# EAGLE design tempShield (EAGLE 7.7.0)
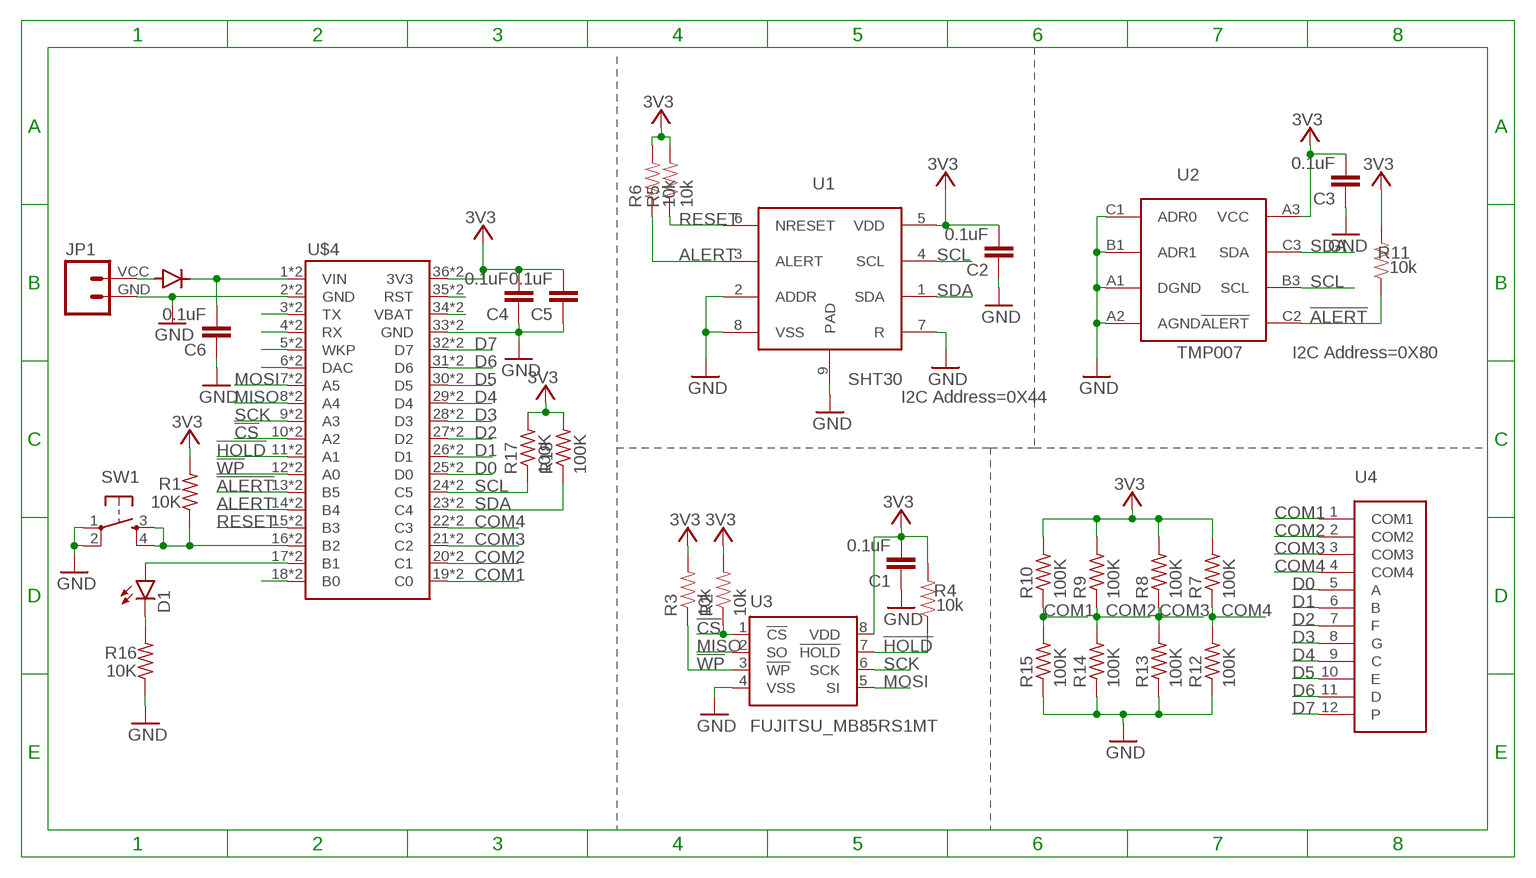
[diagram p0: schematic, sheet 1]

## Parts
C1  0.1uF  0.22UF50V-20%,+80%(0603)  [0603-CAP]
C2  0.1uF  0.22UF50V-20%,+80%(0603)  [0603-CAP]
C3  0.1uF  0.22UF50V-20%,+80%(0603)  [0603-CAP]
C4  0.1uF  0.22UF50V-20%,+80%(0603)  [0603-CAP]
C5  0.1uF  0.22UF50V-20%,+80%(0603)  [0603-CAP]
C6  0.1uF  0.22UF50V-20%,+80%(0603)  [0603-CAP]
D1  LED0603  [LED-0603]
JP1  SPARKFUN-CONNECTORS_M024UCON-15767  [SPARKFUN-CONNECTORS_JST-2-SMD-VERT]
R1  10K  R-US_R0402  [R0402]
R2  10k  0.27OHM-1/10W-1%(0603)  [0603-RES]
R3  10k  0.27OHM-1/10W-1%(0603)  [0603-RES]
R4  10k  0.27OHM-1/10W-1%(0603)  [0603-RES]
R5  10k  0.27OHM-1/10W-1%(0603)  [0603-RES]
R6  10k  0.27OHM-1/10W-1%(0603)  [0603-RES]
R7  100K  R-US_R0402  [R0402]
R8  100K  R-US_R0402  [R0402]
R9  100K  R-US_R0402  [R0402]
R10  100K  R-US_R0402  [R0402]
R11  10k  0.27OHM-1/10W-1%(0603)  [0603-RES]
R12  100K  R-US_R0402  [R0402]
R13  100K  R-US_R0402  [R0402]
R14  100K  R-US_R0402  [R0402]
R15  100K  R-US_R0402  [R0402]
R16  10K  R-US_R0402  [R0402]
R17  100K  R-US_R0402  [R0402]
R18  100K  R-US_R0402  [R0402]
SW1  SWITCH_SPST_4_PIN  [TACTILE-SWITCH-SMD]
U1  SHT30  SHT30SHT30  [SHT30]
U2  TMP007  [TMP007_1]
U3  FUJITSU_MB85RS1MT  [FUJITSU_SO08]
U4  LCD  [LCD]
U$1  PARTICLE_DIODE_NT  [PARTICLE_DIODE-DO-220AA_NT(SMP)]
U$4  MICROBUILDER_ELECTRON_SMT  [MICROBUILDER_ELECTRON_SMT]

## Nets
!ALERT: R11.1 U2.C2(!ALERT!) U$4.13(B5) U$4.13B(B5)
!CS: R2.1 U3.1(!CS) U$4.10(A2) U$4.10B(A2)
!HOLD: R4.1 U3.7(!HOLD) U$4.11(A1) U$4.11B(A1)
!WP: R3.1 U3.3(!WP) U$4.12(A0) U$4.12B(A0)
+3V3: C1.2 C2.2 C3.2 C4.2 C5.2 R1.2 R2.2 R3.2 R4.2 R5.2 R6.2 R7.2 R8.2 R9.2 R10.2 R11.2 R17.2 R18.2 U1.5(VDD) U2.A3(VCC) U3.8(VDD) U$4.36(3V3) U$4.36B(3V3) ; supply symbol labelled 3V3
ALERT: R6.1 U1.3(ALERT) U$4.14(B4) U$4.14B(B4)
COM1: R10.1 R15.2 U4.1(COM1) U$4.19(C0) U$4.19B(C0)
COM2: R9.1 R14.2 U4.2(COM2) U$4.20(C1) U$4.20B(C1)
COM3: R8.1 R13.2 U4.3(COM3) U$4.21(C2) U$4.21B(C2)
COM4: R7.1 R12.2 U4.4(COM4) U$4.22(C3) U$4.22B(C3)
D0: U4.5(A) U$4.25(D0) U$4.25B(D0)
D1: U4.6(B) U$4.26(D1) U$4.26B(D1)
D2: U4.7(F) U$4.27(D2) U$4.27B(D2)
D3: U4.8(G) U$4.28(D3) U$4.28B(D3)
D4: U4.9(C) U$4.29(D4) U$4.29B(D4)
D5: U4.10(E) U$4.30(D5) U$4.30B(D5)
D6: U4.11(D) U$4.31(D6) U$4.31B(D6)
D7: U4.12(P) U$4.32(D7) U$4.32B(D7)
GND: C1.1 C2.1 C3.1 C4.1 C5.1 C6.1 JP1.GND R12.1 R13.1 R14.1 R15.1 R16.1 SW1.1 SW1.2 U1.2(ADDR) U1.7(R) U1.8(VSS) U1.9(PAD) U2.A1(DGND) U2.A2(AGND) U2.B1(ADR1) U2.C1(ADR0) U3.4(VSS) U$4.2(GND) U$4.2B(GND) U$4.33(GND) U$4.33B(GND)
MISO: U3.2(SO) U$4.8(A4) U$4.8B(A4)
MOSI: U3.5(SI) U$4.7(A5) U$4.7B(A5)
N$1: C6.2 U$1.CATHODE U$4.1(VIN) U$4.1B(VIN)
N$2: D1.A U$4.17(B1) U$4.17B(B1)
N$3: JP1.VCC U$1.ANODE
N$4: R1.1 SW1.3 SW1.4 U$4.16(B2) U$4.16B(B2)
N$5: D1.C R16.2
N$6: U$4.35(RST) U$4.35B(RST)
N$7: U$4.34(VBAT) U$4.34B(VBAT)
N$8: U$4.3(TX) U$4.3B(TX)
N$9: U$4.4(RX) U$4.4B(RX)
N$10: U$4.5(WKP) U$4.5B(WKP)
N$11: U$4.6(DAC) U$4.6B(DAC)
N$12: U$4.18(B0) U$4.18B(B0)
RESET: R5.1 U1.6(NRESET) U$4.15(B3) U$4.15B(B3)
SCK: U3.6(SCK) U$4.9(A3) U$4.9B(A3)
SCL: R17.1 U1.4(SCL) U2.B3(SCL) U$4.24(C5) U$4.24B(C5)
SDA: R18.1 U1.1(SDA) U2.C3(SDA) U$4.23(C4) U$4.23B(C4)

## Notes on the sheet
- I2C Address=0X80
- I2C Address=0X44

## Library data of the parts
C1-C6 = SparkFun-Capacitors:0.22UF50V-20%,+80%(0603): CAP-09885; PROD_ID: CAP-09885; VALUE: 0.22uF
D1 = SparkFun-LED:LED: LEDs Standard schematic elements and footprints for 5mm, 3mm, 1206, and 0603 sized LEDs. 5mm - Spark Fun Electronics SKU : COM-00529 (and others)
JP1 = electron_v020:SPARKFUN-CONNECTORS_M02: Standard 2-pin 0.1" header. Use with - straight break away headers ( PRT-00116) - right angle break away headers (PRT-00553) - swiss pins (PRT-00743) - machine pins (PRT-00117) - female headers (PRT-00115) Molex polarized connector foot print use with: PRT-08233 with associated crimp pins and housings. 2.54_SCREWTERM for use with PRT-10571. 3.5mm Screw Terminal footprints for PRT-08084 5mm Screw Terminal footprints for use with PRT-08432
R1 R7-R10 R12-R18 = programming-rig-v402:R-US_: RESISTOR, American symbol
R2-R6 R11 = SparkFun-Resistors:0.27OHM-1/10W-1%(0603): RES-08787; PROD_ID: RES-08787
SW1 = SparkFun-Electromechanical:SWITCH_SPST_4_PIN; PROD_ID: SWCH-08247
U1 = Particle:SHT30
U2 = Particle:TMP007
U3 = fuelview_v001:FUJITSU_MB85RS1MT
U4 = Particle:LCD
U$1 = electron_v020:PARTICLE_DIODE
U$4 = asset-tracker-v007:MICROBUILDER_ELECTRON

## Board
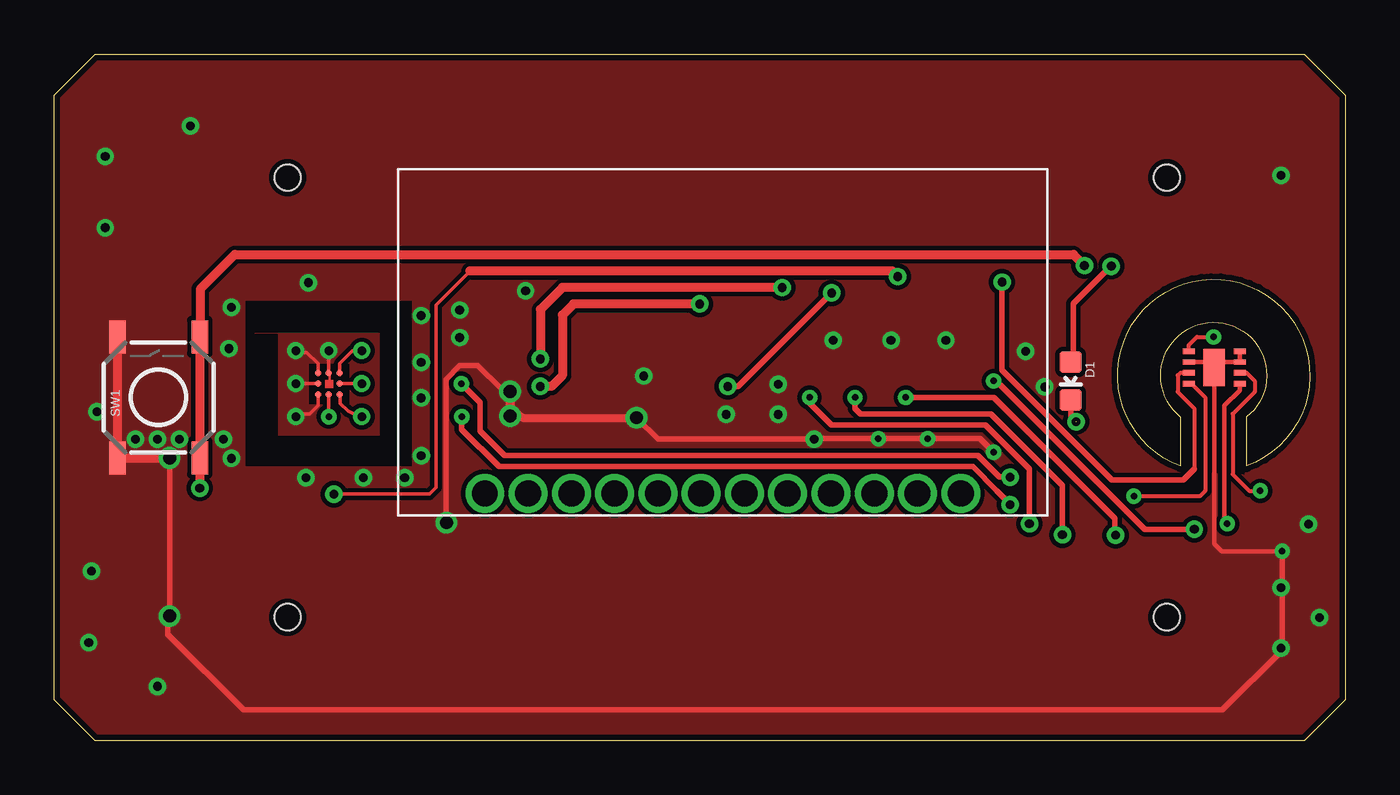
[diagram p1: board, top side]
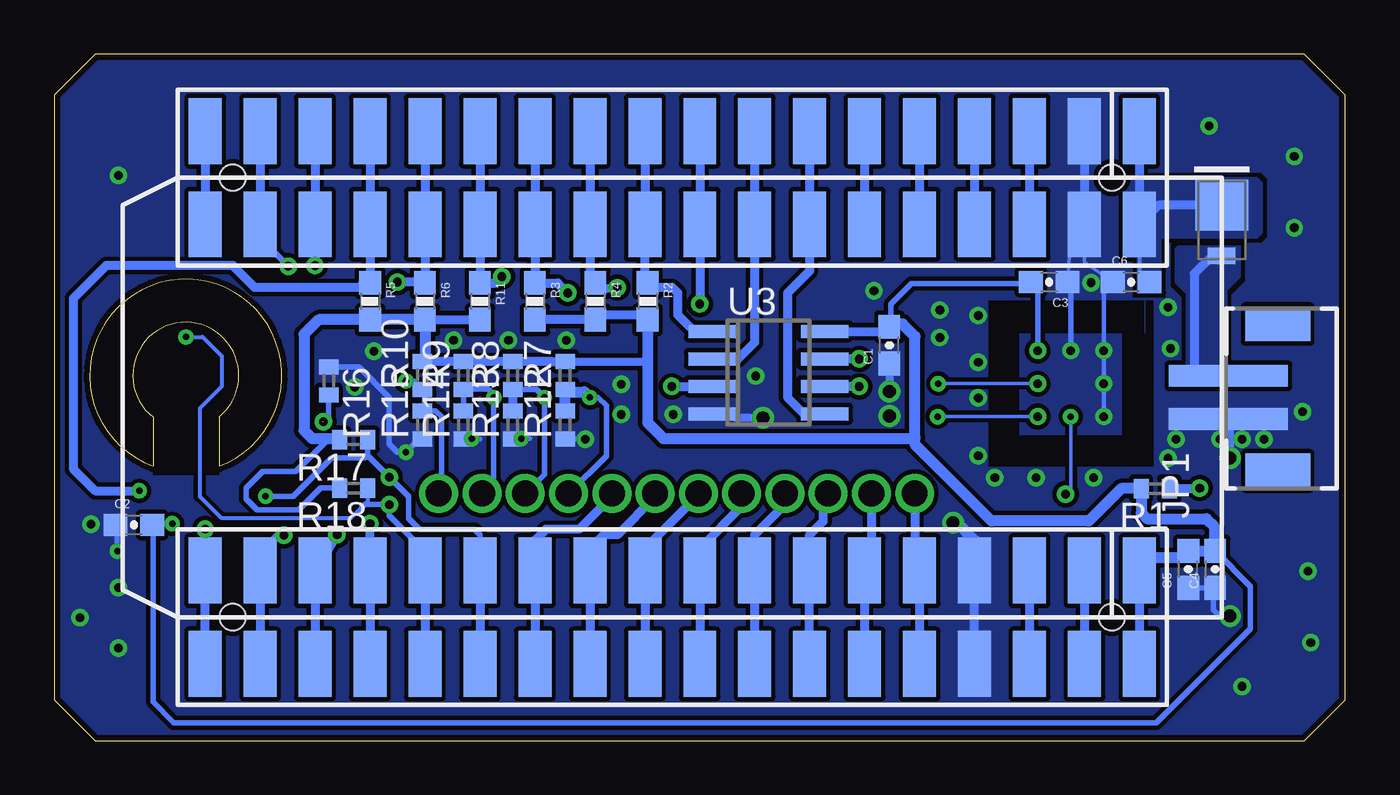
[diagram p2: board, bottom side, seen from below]

Size 59.69 x 31.75 mm. Coordinates in mm from the lower left corner, seen from the top.
Outline: 1.91,31.75 57.78,31.75 59.69,29.84 59.69,1.91 57.78,0 1.91,0 0,1.91 0,29.84 1.91,31.75
Outline: 53.57,19.36 arc-142 55.12,14.96 55.12,12.7 arc167 53.03,21.31 arc152 52.07,12.7 52.07,14.96 arc-140 53.57,19.36
Copper layers (1*16): Top 0.035mm / dielectric 1.5mm / Bottom 0.035mm
Design rules "default *": minimum track width 4mil, minimum drill 0.3mm, track to track 8mil, track to pad 8mil, pad to pad 8mil, via to via 8mil, smd to smd 8mil, copper to edge 10mil, drill to drill 8mil, minimum pad ring 10mil, minimum via ring 8mil, stop-mask expansion 4mil, vias tented up to drill 0.7mm, thermal gap 10mil

### Footprints (pad centres in the part's own frame; a part is rotated, then mirrored left to right if it is on the bottom)
0603-CAP = smd 1.1 x 1: 1 -0.85,0; 2 0.85,0
LED-0603 = smd 1 x 1: A 0,-0.877; C 0,0.877
SPARKFUN-CONNECTORS_JST-2-SMD-VERT = smd 1 x 5.5: GND 1,-2; VCC -1,-2 | smd 1.6 x 3: P$1 -3.4,0.27; P$2 3.4,0.27
R0402 = smd 0.7 x 0.9: 1 -0.65,0; 2 0.65,0
0603-RES = smd 1.1 x 1: 1 -0.85,0; 2 0.85,0
TACTILE-SWITCH-SMD = smd 1.524 x 0.762: 1 -2.794,1.905; 2 2.794,1.905; 3 -2.794,-1.905; 4 2.794,-1.905
SHT30 = smd 0.55 x 0.25: 1 0,1.5; 2 0,1; 3 0,0.5; 4 0,0; 5 2.35,0; 6 2.35,0.5; 7 2.35,1; 8 2.35,1.5 | smd 1 x 1.7: 9 1.175,0.75
TMP007_1 = smd 0.29 x 0.29: A1 -0.5,0.5; A2 0,0.5; A3 0.5,0.5; B1 -0.5,0; B3 0.5,0; C1 -0.5,-0.5; C2 0,-0.5; C3 0.5,-0.5
FUJITSU_SO08 = smd 0.6 x 2.2: 1 -1.905,-2.6; 2 -0.635,-2.6; 3 0.635,-2.6; 4 1.905,-2.6; 5 1.905,2.6; 6 0.635,2.6; 7 -0.635,2.6; 8 -1.905,2.6
LCD = drill 1.2 pad 1.5: 1 0,0; 2 2,0; 3 4,0; 4 6,0; 5 8,0; 6 10,0; 7 12,0; 8 14,0; 9 16,0; 10 18,0; 11 20,0; 12 22,0
PARTICLE_DIODE-DO-220AA_NT(SMP) = smd 0.762 x 1.27: ANODE 2.349,0 | smd 2.337 x 2.464: CATHODE 0,0
MICROBUILDER_ELECTRON_SMT = smd 3.048 x 1.524: 1 -12.319,21.59; 1B -8.001,21.59; 2 -12.319,19.05; 2B -8.001,19.05; 3 -12.319,16.51; 3B -8.001,16.51; 4 -12.319,13.97; 4B -8.001,13.97; 5 -12.319,11.43; 5B -8.001,11.43; 6 -12.319,8.89; 6B -8.001,8.89; 7 -12.319,6.35; 7B -8.001,6.35; 8 -12.319,3.81; 8B -8.001,3.81; 9 -12.319,1.27; 9B -8.001,1.27; 10 -12.319,-1.27; 10B -8.001,-1.27; 11 -12.319,-3.81; 11B -8.001,-3.81; 12 -12.319,-6.35; 12B -8.001,-6.35; 13 -12.319,-8.89; 13B -8.001,-8.89; 14 -12.319,-11.43; 14B -8.001,-11.43; 15 -12.319,-13.97; 15B -8.001,-13.97; 16 -12.319,-16.51; 16B -8.001,-16.51; 17 -12.319,-19.05; 17B -8.001,-19.05; 18 -12.319,-21.59; 18B -8.001,-21.59; 19 12.319,-21.59; 19B 8.001,-21.59; 20 12.319,-19.05; 20B 8.001,-19.05; 21 12.319,-16.51; 21B 8.001,-16.51; 22 12.319,-13.97; 22B 8.001,-13.97; 23 12.319,-11.43; 23B 8.001,-11.43; 24 12.319,-8.89; 24B 8.001,-8.89; 25 12.319,-6.35; 25B 8.001,-6.35; 26 12.319,-3.81; 26B 8.001,-3.81; 27 12.319,-1.27; 27B 8.001,-1.27; 28 12.319,1.27; 28B 8.001,1.27; 29 12.319,3.81; 29B 8.001,3.81; 30 12.319,6.35; 30B 8.001,6.35; 31 12.319,8.89; 31B 8.001,8.89; 32 12.319,11.43; 32B 8.001,11.43; 33 12.319,13.97; 33B 8.001,13.97; 34 12.319,16.51; 34B 8.001,16.51; 35 12.319,19.05; 35B 8.001,19.05; 36 12.319,21.59; 36B 8.001,21.59 | hole 1.2: -10.16,20.32; 10.16,20.32; 10.16,-20.32; -10.16,-20.32

### Placement (x,y rotation side)
C1  21.08,18.29 90 bottom
C2  56.01,9.98 0 bottom
C3  13.69,21.21 180 bottom
C4  6.02,7.92 90 bottom
C5  7.26,7.92 90 bottom
C6  9.91,21.21 0 bottom
D1  46.99,16.64 180 top
JP1  3.4,15.88 270 bottom
R1  8.79,11.66 180 bottom
R2  32.26,20.32 270 bottom
R3  37.47,20.32 270 bottom
R4  34.67,20.32 270 bottom
R5  45.09,20.32 270 bottom
R6  42.55,20.32 270 bottom
R7  36.07,16.89 90 bottom
R8  38.48,16.89 90 bottom
R9  40.77,16.89 90 bottom
R10  42.67,16.89 90 bottom
R11  40.01,20.32 270 bottom
R12  36.07,14.61 90 bottom
R13  38.48,14.61 90 bottom
R14  40.77,14.61 90 bottom
R15  42.67,14.61 90 bottom
R16  46.99,16.64 270 bottom
R17  45.85,13.92 180 bottom
R18  45.85,11.68 180 bottom
SW1  4.83,15.88 90 top
U1  52.45,16.51 0 top
U2  12.7,16.51 0 top
U3  26.67,17.02 270 bottom
U4  41.91,11.43 180 top
U$1  5.71,24.77 270 bottom
U$4  31.11,15.88 270 bottom

### Tracks (layer width: path | path; a pad name or v marks a point on that pad's centre or on a via)
!ALERT  (via drill 0.3 pad 0.4, 0.4 pad 0.5, 0.4 pad 0.6)
  Top 0.152: U2.C2 v12.7,14.99 | v12.93,11.4 17.35,11.4 17.65,11.71 17.65,20.14 18.29,20.78 18.62,21.11 19.23,21.72
  Top 0.406: v38.99,21.46 38.73,21.72 19.23,21.72
  Bottom 0.152: v12.7,14.99 12.7,11.61 12.72,11.61 v12.93,11.4
  Bottom 0.406: U$4.13 U$4.13B R11.1 39.28,21.17 v38.99,21.46
!CS
  Bottom 0.178: R2.1 32.26,21.59 32.38,21.72
  Bottom 0.406: U$4.10 U$4.10B 32.38,21.72 | 29.34,18.99 U3.1 30.1,18.92 30.86,19.68 30.86,20.7 31.11,20.95 32.04,20.95 R2.1
!HOLD  (via drill 0.4 pad 0.6)
  Top 0.406: v33.66,20.95 23.5,20.95 22.48,19.94 v22.48,17.65
  Bottom 0.406: U$4.11 U$4.11B 34.92,21.42 R4.1 34.46,20.92 v33.66,20.95 | v22.48,17.65 U3.7
!WP  (via drill 0.4 pad 0.6)
  Top 0.254: v31.14,16.38 31.62,16.38 v35.94,20.7
  Bottom 0.406: U$4.12 U$4.12B R3.1 36.41,21.17 v35.94,20.7 | v31.14,16.38 U3.3
+3V3  (via drill 0.3 pad 0.5, 0.38 pad 0.76)
  Top 0.152: U2.A3 13.2,17.44 13.77,18.01 14.2,18.01 v14.22,18.03
  Top 0.203: U1.5 54.8,16.19 54.1,15.49 54.1,10.29 v54.23,10.03 53.98,10.03
  Bottom 0.152: 14.63,21.13 14.49,21.13 C3.2 14.22,21.02 14.22,20.73
  Bottom 0.254: v14.22,18.03 14.22,20.73 | C1.2 21.01,19.21 21.01,20.19 20.07,21.13 14.63,21.13 | 55.11,10.03 55.11,1.79 54.15,0.84 8.74,0.84 4.39,5.18 4.39,7.15 C4.2 5.96,8.71 | v54.23,10.03 55.11,10.03 | 55.11,10.03 C2.2 | R17.2 46.57,13.84 47.12,13.84 48.51,12.45 50.04,12.45 50.8,11.68 50.8,11.18 50.29,10.67 48.39,10.67 47.37,11.68 R18.2
  Bottom 0.381: 36.7,17.54 32.2,17.54 32.26,17.48
  Bottom 0.406: R10.2 R9.2 R8.2 36.7,17.54 R7.2 | U3.8 21.04,18.92 C1.2 21.04,19.18 | R2.2 32.26,19.56 32.38,19.68 34.46,19.68 R4.2 R3.2 37.47,19.43 | U$4.36 U$4.36B 9.53,8.46 | 9.53,9.02 9.53,8.46 | R6.2 R11.2 | 9.5,8.48 9.53,8.46
  Bottom 0.508: 9.5,8.48 7.55,8.48 C5.2 C4.2 6.07,8.83 6.07,9.91 6.43,10.26 9.17,10.26 9.44,10.53 R1.2 10.36,11.66 11.86,10.16 16.36,10.16 19.89,13.69 19.89,14.02 | 19.89,14.02 19.89,18.69 20.47,19.28 20.94,19.28 C1.2 | R2.2 32.26,17.48 32.26,14.71 31.52,13.97 19.94,13.97 19.89,14.02 | 46.41,14.01 R17.2 46.55,13.97 47.75,13.97 48.13,14.35 48.13,18.8 47.46,19.47 R5.2 R6.2 42.55,17.67 R10.2
ALERT  (via drill 0.4 pad 0.6)
  Top 0.178: U1.3 52.06,17.01 51.94,16.89 51.94,16.13 52.7,15.37 52.7,12.57
  Top 0.254: v43.81,21.21 43.81,17.14 48.9,12.06 52.2,12.06 52.7,12.57
  Bottom 0.406: U$4.14 U$4.14B 42.55,21.21 | 42.55,21.21 R6.1 | 42.55,21.21 v43.81,21.21
COM1  (via drill 0.3 pad 0.4, 0.4 pad 0.6)
  Top 0.254: v52.7,9.78 50.42,9.78 43.56,16.64 v43.43,16.64
  Bottom 0.254: 42.55,16.38 42.56,16.13 | 42.56,16.13 R10.1 43.07,16.64 v43.43,16.64 | 42.56,16.13 42.56,15.37 R15.2 42.05,15.26 41.78,14.99 41.78,11.56 U4.1
  Bottom 0.406: v52.7,9.78 U$4.19B U$4.19
COM2  (via drill 0.3 pad 0.4, 0.4 pad 0.6)
  Top 0.254: v39.37,15.88 43.43,15.88 49.02,10.29 49.02,9.55 v49.07,9.5
  Bottom 0.254: v49.07,9.5 49.4,9.5 50.14,8.76 | U4.2 39.37,11.97 v39.37,15.88 39.37,16 39.62,16.26 40.66,16.26 R9.1 R14.2
  Bottom 0.406: 40.77,15.38 R14.2 | U$4.20 U$4.20B 50.14,7.9 50.14,8.76 50.14,9.04
COM3  (via drill 0.3 pad 0.4, 0.4 pad 0.6)
  Top 0.254: v46.61,9.53 46.61,11.81 43.31,15.11 37.27,15.11 37.02,15.37 v37.02,15.88
  Bottom 0.254: U4.3 37.02,12.32 v37.02,15.88 37.39,16.24 R8.1
  Bottom 0.406: R13.2 R8.1 | v46.61,9.53 U$4.21B U$4.21
COM4  (via drill 0.3 pad 0.4, 0.4 pad 0.6)
  Top 0.254: v45.09,10.03 45.09,12.57 43.05,14.61 35.94,14.61 34.92,15.62 v34.92,15.88
  Bottom 0.254: R7.1 36.07,16.13 | v34.92,15.88 34.54,15.88 34.16,15.49 34.16,13.18 U4.4
  Bottom 0.406: v45.09,10.03 U$4.22B U$4.22
  Bottom 0.508: R12.2 36.07,16.13 35.18,16.13 v34.92,15.88
D0
  Bottom 0.406: U4.5 33.91,11.3 35.43,9.78 36.96,9.78 37.47,9.27 U$4.25B U$4.25
D1
  Bottom 0.406: U4.6 31.91,11.27 33.66,9.53 34.29,9.53 34.92,8.89 U$4.26B U$4.26
D2
  Bottom 0.406: U4.7 29.91,11.37 32.38,8.89 U$4.27B U$4.27
D3
  Bottom 0.406: U4.8 27.91,10.82 29.84,8.89 U$4.28B U$4.28
D4
  Bottom 0.406: U4.9 25.91,10.92 27.3,9.53 U$4.29B U$4.29
D5
  Bottom 0.406: U$4.30 U$4.30B 24.77,9.53 24.13,10.16 24.13,11.21 U4.10
D6
  Bottom 0.406: U4.11 21.91,8.19 U$4.31B U$4.31
D7
  Bottom 0.406: U4.12 19.91,8.1 U$4.32B U$4.32
GND  (via drill 0.3 pad 0.4, 0.3 pad 0.5, 0.38 pad 0.76, 0.4 pad 0.5, 0.6 pad 0.5)
  Top 0.127: U2.A2 12.72,17.01 12.72,16.48
  Top 0.152: U2.B1 v11.18,16.51 | 12.7,17.55 U2.A2 v12.7,18.03 | U2.C1 12.2,15.5 11.81,15.11 11.3,15.11 v11.18,14.99 | U2.A1 12.2,17.44 11.68,17.96 11.25,17.96 v11.18,18.03
  Top 0.203: U1.8 U1.7 53.88,17.51 U1.9 | U1.2 53.38,17.51 U1.9 | U1.9 53.63,9.11 53.98,8.76 v56.77,8.76
  Top 0.254: v26.92,14.94 27.91,13.95 v35.13,13.95 34.9,13.97 v38.1,13.97 v40.39,13.97 42.8,13.97 v43.43,13.34 | v18.14,10.08 18.11,10.11 18.11,16.71 18.75,17.35 19.58,17.35 20.65,16.28 20.95,16.28 v21.08,16.15 | v5.33,13.08 v5.33,5.77 5.26,5.69 5.26,4.93 8.76,1.42 54,1.42 56.77,4.19 v56.77,8.76
  Top 0.381: 21.08,15.37 21.67,14.94 v26.92,14.94
  Top 0.406: SW1.2 SW1.1 v5.33,13.08 | v21.08,16.15 21.08,15.37
  Bottom 0.152: 17.17,7.9 U$4.33B | C6.1 12.06,22.14 U$4.2B 12.71,23.23 C3.1 12.71,20.54 12.7,20.52 | 11.18,21.23 11.15,21.26 11.12,21.26 11.1,21.23 11.1,21.26 11.07,21.29
  Bottom 0.203: 56.77,9.89 C2.1 | v11.18,14.99 11.18,21.23
  Bottom 0.254: v12.7,18.03 12.7,20.52 12.7,21.03 | 11.16,21.18 C6.1 | R12.1 35.95,13.96 v35.13,13.95 | 47.04,17.34 R16.1 46.98,17.27 45.59,17.27 44.2,15.88 44.2,13.72 43.81,13.34 v43.43,13.34 42.81,13.96 R15.1 | v5.33,5.77 5.82,5.77 6.1,6.04 6.1,7 C4.1 C5.1 | 56.77,9.89 v56.77,8.76 | R13.1 37.7,13.98 v38.1,13.97 | R14.1 40.02,13.96 v40.39,13.97
  Bottom 0.381: C1.1 v21.08,16.15 | v26.92,14.94 28.19,14.94 28.55,15.11 U3.4
  Bottom 0.406: U$4.2 U$4.2B | U$4.33 U$4.33B 17.27,8 | v5.33,13.08 5.33,14.8 JP1.GND
  Bottom 0.508: v18.14,10.08 17.96,10.08 17.14,9.27 U$4.33B
  other vias: 21.08,15.01 31.06,15.09 16.97,19.66 16.97,17.5 16.97,15.85 16.97,13.18 16.21,12.17 14.3,12.17 11.63,12.17 8.2,13.06 8.08,18.14 8.2,20.04 18.75,19.91 18.75,18.64 21.79,20.8 27.25,16.87 33.48,16.48 33.48,15.09 36.02,18.52 38.68,18.52 41.22,18.52 44.91,18.01 45.8,16.36 57.99,10.01 56.72,7.09 56.72,4.29 3.76,13.94 4.78,13.94 5.79,13.94 7.82,13.94 11.76,21.18 4.78,2.51 1.6,4.55 1.73,7.85 1.98,15.21 2.36,23.72 2.36,27.03 6.3,28.42 56.72,26.14 58.5,5.69
  pour Top (no thermals): 10.41,18.8 14.99,18.8 14.99,14.22 10.41,14.22
  pour Bottom (isolate 0.127, no thermals): 10.41,18.8 14.99,18.8 14.99,14.22 10.41,14.22
  pour Bottom (rank 2, no thermals): 1.91,31.75 57.78,31.75 59.69,29.84 59.69,1.91 57.78,0 1.91,0 0,1.91 0,29.84
  pour Top (rank 2, no thermals): 1.91,31.75 57.78,31.75 59.69,29.84 59.69,1.91 57.78,0 1.91,0 0,1.91 0,29.84
  pour Bottom (rank 2, no thermals): 11.3,23.75 13.34,23.75 13.34,20.7 10.16,20.7 10.16,21.97 11.3,21.97
MISO
  Bottom 0.406: U$4.8 U$4.8B 27.3,18.41 28.07,17.65 U3.2
MOSI
  Bottom 0.406: U$4.7 U$4.7B 24.77,21.72 25.78,20.7 25.78,15.88 25.02,15.11 U3.5
N$1
  Bottom 0.178: U$4.1B 9.53,21.3 C6.2
  Bottom 0.406: U$4.1 U$4.1B 8.64,24.77 U$1.CATHODE
  pour Bottom (no thermals): 9.78,26.04 10.29,25.4 10.29,22.35 9.65,22.35 9.65,20.7 8.51,20.7 8.51,23.24 4.06,23.24 3.81,23.5 3.81,25.78 4.06,26.04
N$2  (via drill 0.4 pad 0.6)
  Top 0.178: 47.12,19.43 47.12,17.64
  Top 0.254: v48.87,21.95 48.84,21.95 47.12,20.22 47.12,17.64 D1.A
  Bottom 0.254: U$4.17B 50.16,23.24 v48.87,21.95
  Bottom 0.406: U$4.17 U$4.17B
N$3
  Bottom 0.406: U$1.ANODE 6.16,22.42 6.99,21.59 6.99,17.14 5.67,17.14 JP1.VCC
  pour Bottom (no thermals): 4.83,22.86 7.75,22.86 7.87,22.73 7.87,21.21 7.37,20.7 7.37,16.89 7.24,16.76 5.59,16.76 5.46,16.89 5.46,20.83 4.83,21.46
N$4  (via drill 0.4 pad 0.6)
  Top 0.406: v47.62,21.97 47.12,22.48 8.36,22.48 6.76,20.88 6.76,18.69 SW1.4 SW1.3 v6.73,11.68
  Bottom 0.406: U$4.16 U$4.16B v47.62,21.97 | R1.1 v6.74,11.67 v6.73,11.68
N$5  (via drill 0.4 pad 0.5)  (1 unrouted)
  Top 0.254: D1.C 46.99,15.01 v47.24,14.76
  Bottom 0.254: 47.24,14.73 46.99,14.99 R16.2
N$6
  Bottom 0.406: U$4.35B U$4.35
N$7
  Bottom 0.406: U$4.34B U$4.34
N$8
  Bottom 0.406: U$4.3 U$4.3B
N$9
  Bottom 0.406: U$4.4 U$4.4B
N$10
  Bottom 0.406: U$4.5 U$4.5B
N$11
  Bottom 0.406: U$4.6 U$4.6B
N$12
  Bottom 0.406: U$4.18 U$4.18B
N$13
  cutout Top: 11.81,17.42 13.61,17.42 13.61,15.57 11.81,15.57
N$14
  cutout Top: 9.3,20.32 16.51,20.32 16.51,12.7 8.89,12.7 8.89,20.32 9.22,20.32 9.22,18.8 10.31,18.8 10.31,14.1 15.09,14.1 15.09,18.87 9.3,18.87
N$15
  cutout Bottom: 9.3,20.32 16.51,20.32 16.51,12.7 8.89,12.7 8.89,20.32 9.22,20.32 9.22,18.8 10.31,18.8 10.31,14.1 15.09,14.1 15.09,18.87 9.3,18.87
N$16
  cutout Bottom: 51.05,19.3 56.13,19.3 55.12,12.32 52.07,12.32
N$17
  cutout Top: 51.05,19.3 56.13,19.3 54.99,12.32 52.07,12.45
RESET  (via drill 0.3 pad 0.5)
  Top 0.178: U1.6 55.13,17.01 55.5,16.64 55.5,16.13 54.48,15.11 54.48,12.32 55.24,11.56 v55.75,11.56
  Bottom 0.406: U$4.15 U$4.15B R5.1 45.38,21.17 45.59,20.95 50.42,20.95 51.44,21.97 57.28,21.97 58.8,20.45 58.8,12.57 57.78,11.56 v55.75,11.56
SCK  (via drill 0.4 pad 0.6)
  Top 0.406: v22.48,16.38 22.99,16.38 23.5,16.89 23.5,19.68 24,20.19 v29.84,20.19
  Bottom 0.406: U$4.9 U$4.9B v29.84,20.19 | v22.48,16.38 U3.6
SCL  (via drill 0.3 pad 0.4, 0.38 pad 0.76, 0.4 pad 0.6)
  Top 0.152: U2.B3 v14.22,16.51
  Top 0.178: U1.4 52.58,16.51 53.21,15.88 53.21,11.56 52.96,11.3 v49.91,11.3
  Top 0.254: v18.82,16.51 19.68,15.65 19.68,14.33 20.83,13.18 42.7,13.18 43.69,12.19 v44.2,12.19
  Bottom 0.152: v14.22,16.51 v18.82,16.51
  Bottom 0.254: 40.01,9.02 40.01,9.53 40.26,9.78 42.8,9.78 43.31,10.29 43.31,11.3 v44.2,12.19 45.2,13.19 R17.1 | R17.1 45.2,14.21 | v49.91,11.3 48.64,11.3 46.86,13.08 45.34,13.08 45.2,13.22 R17.1
  Bottom 0.406: 40.01,9.02 U$4.24B U$4.24
SDA  (via drill 0.3 pad 0.4, 0.38 pad 0.76, 0.4 pad 0.6)
  Top 0.152: U2.C3 13.22,16.01 13.22,15.6 13.59,15.24 14.15,14.96 v14.22,14.99
  Top 0.178: U1.1 52.45,18.29 52.83,18.67 v53.59,18.67
  Top 0.254: v44.2,10.92 43.59,11.56 42.47,12.68 20.57,12.68 18.85,14.4 v18.85,14.99
  Bottom 0.152: v14.22,14.99 v18.85,14.99
  Bottom 0.178: R18.1 45.2,11.06 45.47,10.79 45.97,10.29 51.94,10.29 52.96,11.3 52.96,15.37 51.94,16.38 51.94,17.78 52.83,18.67 v53.59,18.67
  Bottom 0.254: 42.55,9.03 42.81,9.03 44.2,10.41 v44.2,10.92 45.34,10.92 45.47,10.79
  Bottom 0.406: 42.55,9.03 U$4.23B U$4.23
(copper drawn outside any net)
  shapes: Top area x1